# Altium schematic sheet RCS_main_shematic.SchDoc
size A4; SheetNumber: 1; SheetTotal: 7
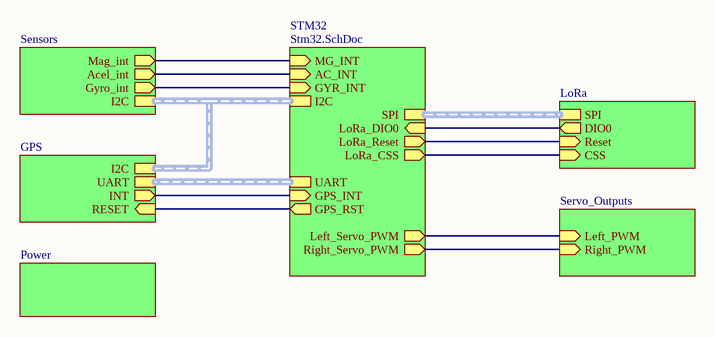
[diagram p0: RCS_main_shematic.SchDoc]

## Sub-sheets
GPS = GPS.SchDoc: INT (out), RESET (in), UART (harness UART), I2C (harness I2C)
LoRa = LoRa.SchDoc: CSS (in), Reset (in), DIO0 (out), SPI (harness SPI)
Power = Power.SchDoc: no entries
Sensors = Sensors.SchDoc: Mag_int (out), Acel_int (out), Gyro_int (out), I2C (harness I2C)
Servo_Outputs = Servo_Outputs.SchDoc: Right_PWM (in), Left_PWM (in)
STM32 = Stm32.SchDoc: MG_INT (in), AC_INT (in), GYR_INT (in), I2C (harness I2C), SPI (harness SPI), LoRa_DIO0 (in), LoRa_Reset (out), LoRa_CSS (out), UART (harness UART), GPS_INT (in), GPS_RST (out), Left_Servo_PWM (out), Right_Servo_PWM (out)

## Nets
(unnamed): sheet LoRa/CSS, sheet STM32/LoRa_CSS
(unnamed): sheet LoRa/Reset, sheet STM32/LoRa_Reset
(unnamed): sheet LoRa/DIO0, sheet STM32/LoRa_DIO0
(unnamed): sheet Sensors/Mag_int, sheet STM32/MG_INT
(unnamed): sheet Sensors/Acel_int, sheet STM32/AC_INT
(unnamed): sheet Sensors/Gyro_int, sheet STM32/GYR_INT
(unnamed): sheet STM32/GPS_INT, sheet GPS/INT
(unnamed): sheet STM32/GPS_RST, sheet GPS/RESET
(unnamed): sheet STM32/Left_Servo_PWM, sheet Servo_Outputs/Left_PWM
(unnamed): sheet STM32/Right_Servo_PWM, sheet Servo_Outputs/Right_PWM

## Buses and harness runs
harness sheet GPS/I2C = sheet Sensors/I2C = sheet STM32/I2C
harness sheet GPS/UART = sheet STM32/UART
harness sheet LoRa/SPI = sheet STM32/SPI

## Notes on the sheet
- Author:
- Title:
- Sheet number:
- Modified:
- /
- Reviewers:
- Description: